# EAGLE design Display (EAGLE 7.7.0)
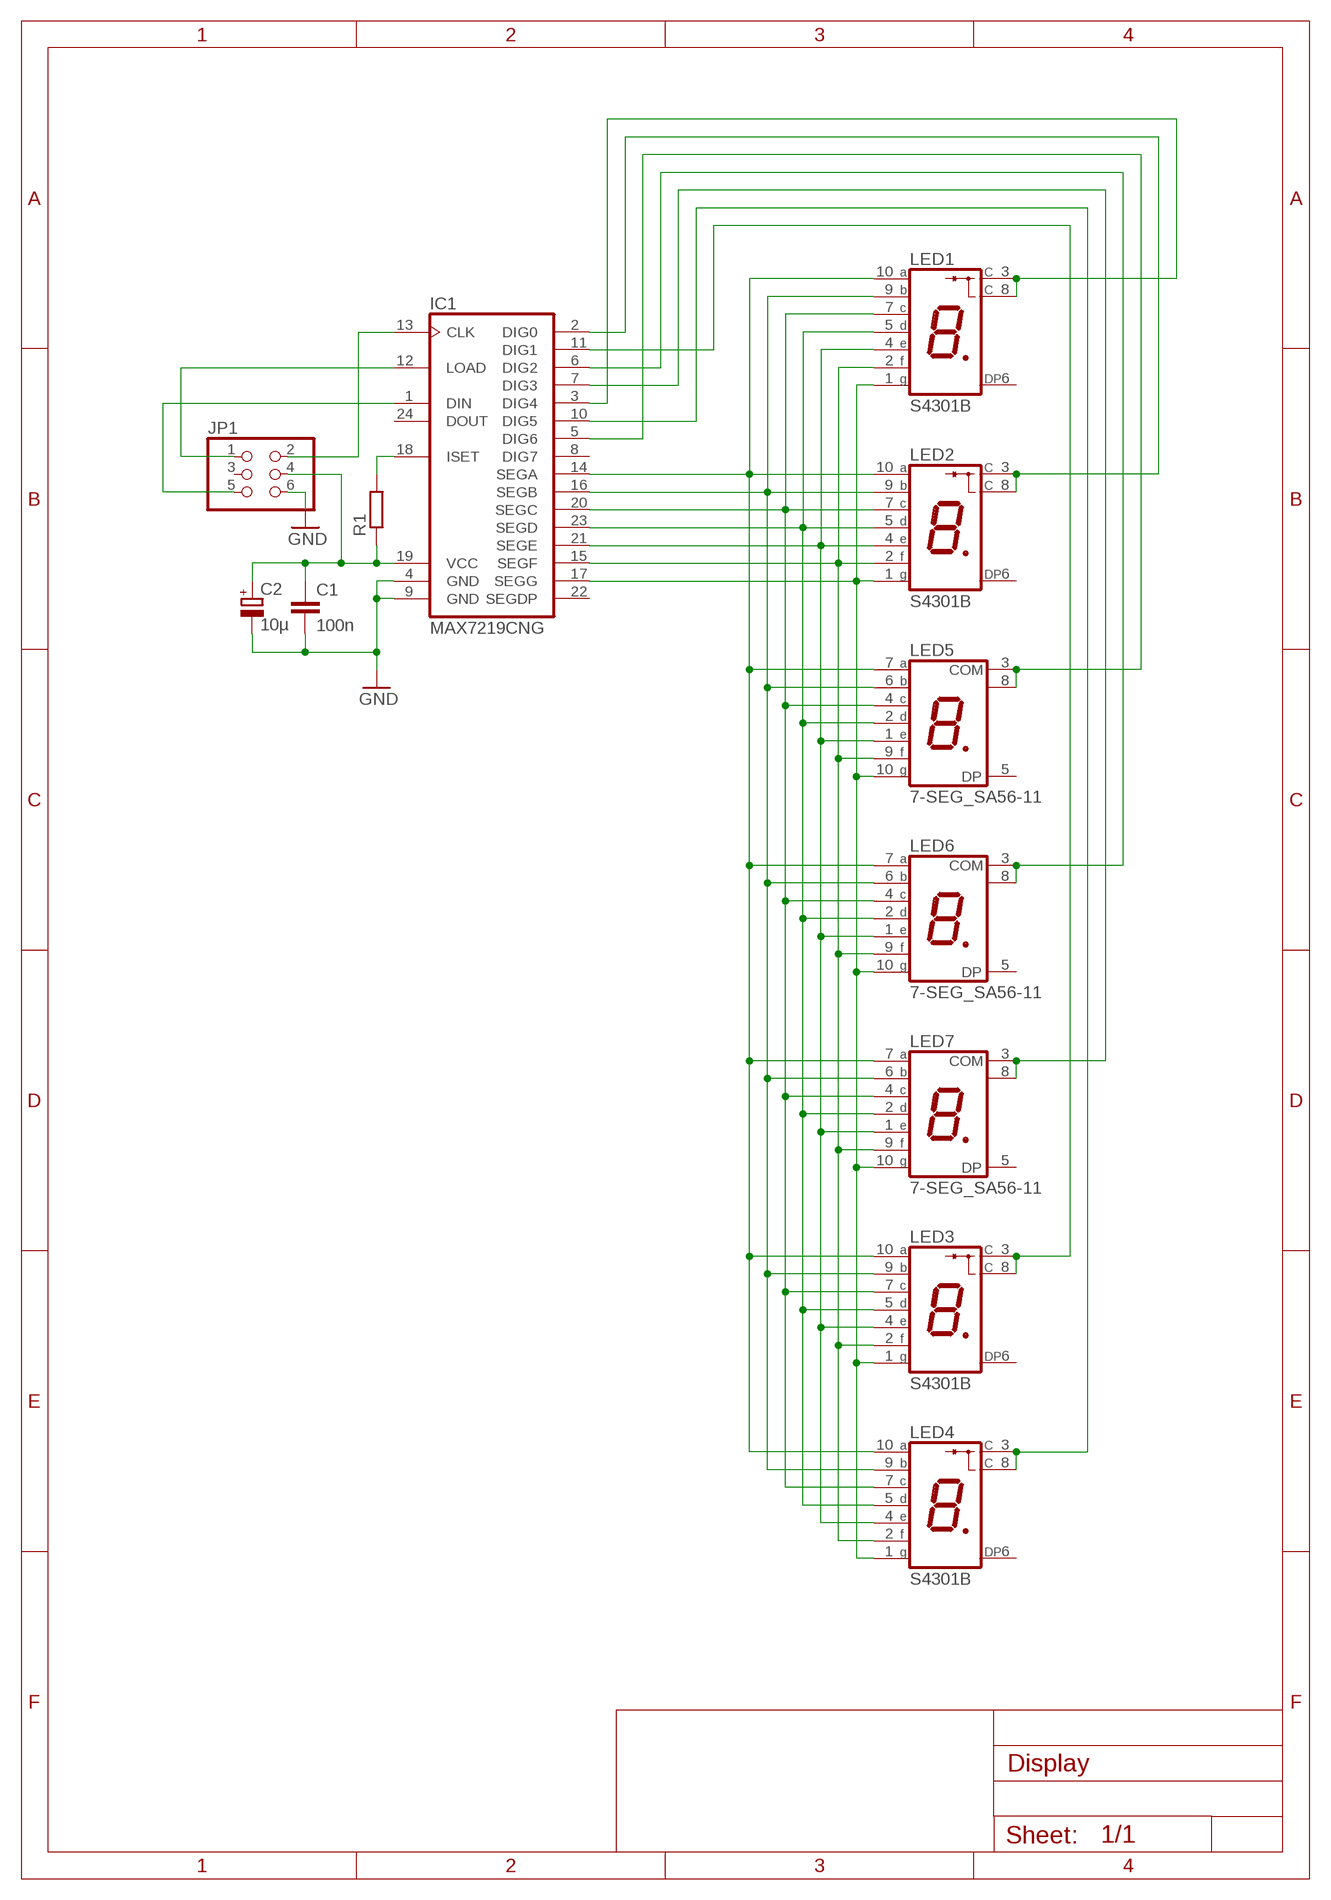
[diagram p0: schematic, sheet 1]

## Parts
C1  100n  C-EUC0805  [C0805]
C2  10µ  CPOL-EUB  [PANASONIC_B]
IC1  MAX7219CNG  [DIL24-3]
JP1  PINHD-2X03_2.54  [2X03]
LED1  S4301B  [S4301B]
LED2  S4301B  [S4301B]
LED3  S4301B  [S4301B]
LED4  S4301B  [S4301B]
LED5  7-SEG_SA56-11  [SA56-11]
LED6  7-SEG_SA56-11  [SA56-11]
LED7  7-SEG_SA56-11  [SA56-11]
R1  R-EU_R0805  [R0805]

## Nets
GND: C1.2 C2.- IC1.4(GND) IC1.9(GND) JP1.6
N$1: IC1.17(SEGG) LED1.1(G) LED2.1(G) LED3.1(G) LED4.1(G) LED5.10(G) LED6.10(G) LED7.10(G)
N$2: IC1.15(SEGF) LED1.2(F) LED2.2(F) LED3.2(F) LED4.2(F) LED5.9(F) LED6.9(F) LED7.9(F)
N$3: IC1.21(SEGE) LED1.4(E) LED2.4(E) LED3.4(E) LED4.4(E) LED5.1(E) LED6.1(E) LED7.1(E)
N$4: IC1.23(SEGD) LED1.5(D) LED2.5(D) LED3.5(D) LED4.5(D) LED5.2(D) LED6.2(D) LED7.2(D)
N$5: IC1.20(SEGC) LED1.7(C) LED2.7(C) LED3.7(C) LED4.7(C) LED5.4(C) LED6.4(C) LED7.4(C)
N$6: IC1.16(SEGB) LED1.9(B) LED2.9(B) LED3.9(B) LED4.9(B) LED5.6(B) LED6.6(B) LED7.6(B)
N$7: IC1.14(SEGA) LED1.10(A) LED2.10(A) LED3.10(A) LED4.10(A) LED5.7(A) LED6.7(A) LED7.7(A)
N$8: IC1.3(DIG4) LED1.3(C) LED1.8(C)
N$9: IC1.2(DIG0) LED2.3(C) LED2.8(C)
N$10: IC1.5(DIG6) LED5.3(COM) LED5.8(COM)
N$11: IC1.6(DIG2) LED6.3(COM) LED6.8(COM)
N$12: IC1.7(DIG3) LED7.3(COM) LED7.8(COM)
N$13: IC1.10(DIG5) LED4.3(C) LED4.8(C)
N$14: IC1.11(DIG1) LED3.3(C) LED3.8(C)
N$15: IC1.1(DIN) JP1.5
N$16: IC1.12(LOAD) JP1.1
N$17: IC1.13(CLK) JP1.2
N$18: C1.1 C2.+ IC1.19(VCC) JP1.4 R1.1
N$19: IC1.18(ISET) R1.2
Unconnected: IC1.8(DIG7) IC1.22(SEGDP) IC1.24(DOUT) JP1.3 LED1.6(DP) LED2.6(DP) LED3.6(DP) LED4.6(DP) LED5.5(DP) LED6.5(DP) LED7.5(DP)

## Library data of the parts
C1 = rcl:C-EU: CAPACITOR, European symbol
C2 = rcl:CPOL-EU: POLARIZED CAPACITOR, European symbol
IC1 = maxim7219:MAX7219*: Serially Interfaced, 8-Digit LED Display Drivers
JP1 = pinhead-2:PINHD-2X03: PIN HEADER
LED1-LED4 = led-7-segment:S4301B: Single Digit Seven-Segment Display (cathode common) Source: LITEON .. S4301B.pdf; OC_FARNELL: unknown; OC_NEWARK: unknown
LED5-LED7 = display-kingbright:7-SEG_: Kingbright 14.2mm (0.56 INCH) SINGLE DIGIT NUMERIC DUISPLAY Source: SA56-11EWA(Ver1189471036.pdf; OC_FARNELL: unknown; OC_NEWARK: unknown
R1 = rcl:R-EU_: RESISTOR, European symbol

## Board
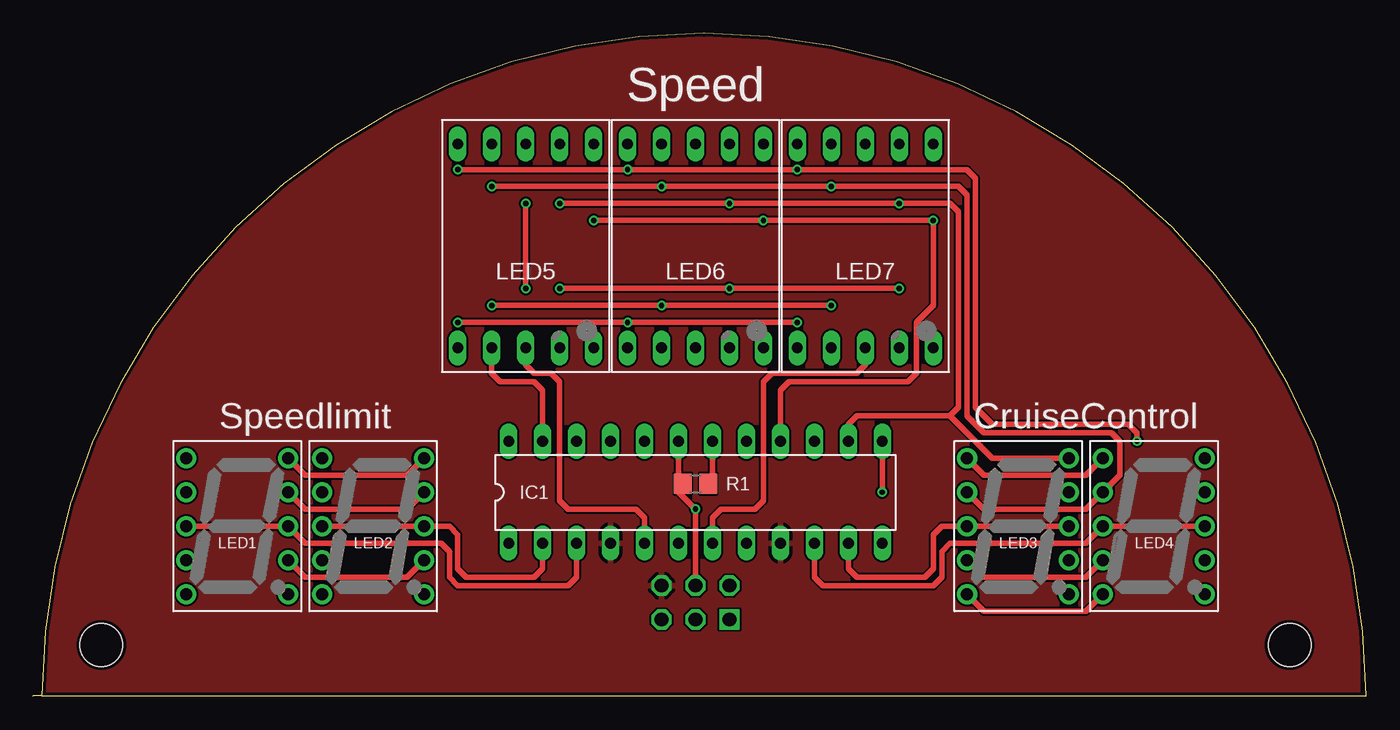
[diagram p1: board, top side]
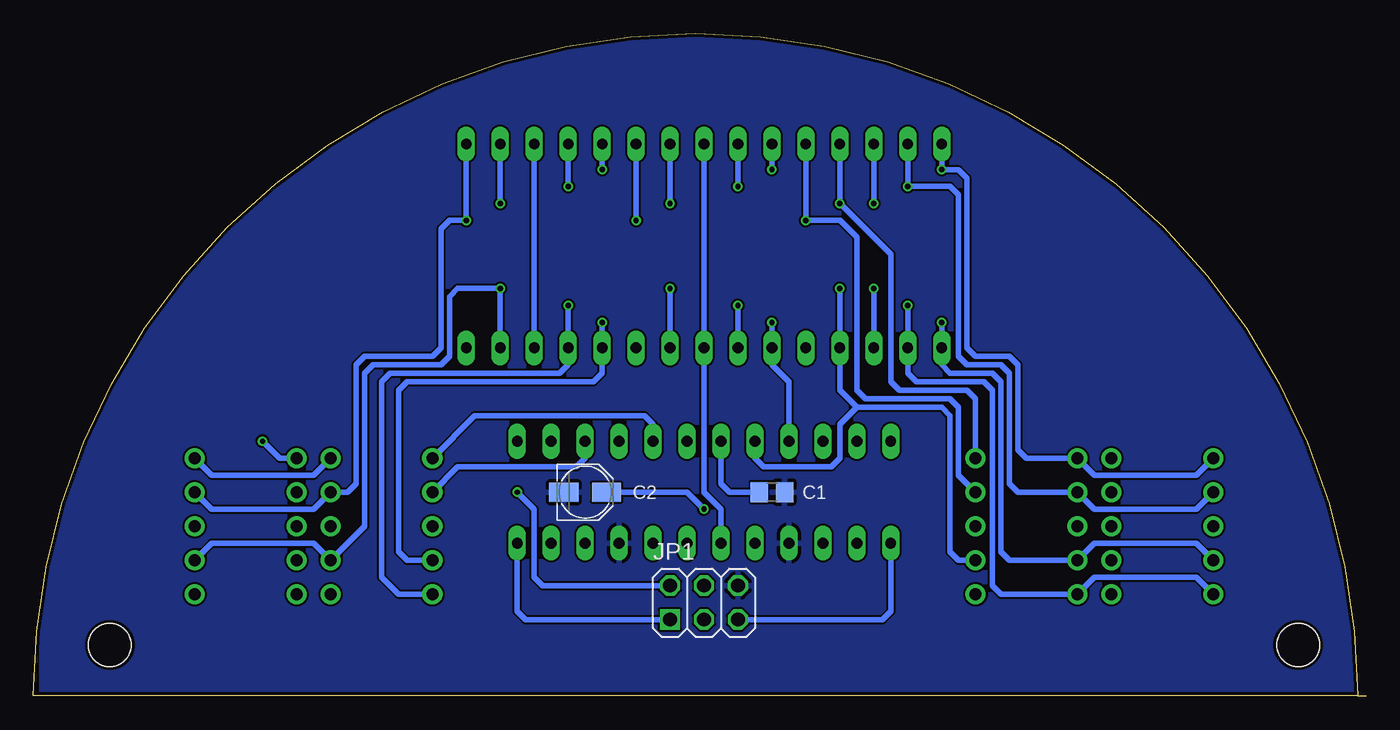
[diagram p2: board, bottom side, seen from below]

Size 99.69 x 49.56 mm. Coordinates in mm from the lower left corner, seen from the top.
Outline: 0.64,0.01 99.69,0.01 arc180 0.64,0.01
Outline: 0.64,0.01 0,0.01 0,0
Copper layers (1*16): Top 0.035mm / dielectric 1.5mm / Bottom 0.035mm
Design rules "Elecrow_2-layer_eagle_rule": minimum track width 6mil, minimum drill 12mil, track to track 6mil, track to pad 6mil, pad to pad 6mil, via to via 6mil, smd to smd 0mil, copper to edge 10mil, drill to drill 10mil, minimum pad ring 10mil, minimum via ring 6mil, stop-mask expansion 2mil, vias tented up to drill 100mil, thermal gap 10mil
Holes 3.2 mm at 5.08,3.82 93.98,3.82

### Footprints (pad centres in the part's own frame; a part is rotated, then mirrored left to right if it is on the bottom)
C0805 = smd 1.3 x 1.5: 1 -0.95,0; 2 0.95,0
PANASONIC_B = smd 2.2 x 1.4: + 1.6,0; - -1.6,0
DIL24-3 = drill 0.813 long: 1 -13.97,-3.81; 2 -11.43,-3.81; 3 -8.89,-3.81; 4 -6.35,-3.81; 5 -3.81,-3.81; 6 -1.27,-3.81; 7 1.27,-3.81; 8 3.81,-3.81; 9 6.35,-3.81; 10 8.89,-3.81; 11 11.43,-3.81; 12 13.97,-3.81; 13 13.97,3.81; 14 11.43,3.81; 15 8.89,3.81; 16 6.35,3.81; 17 3.81,3.81; 18 1.27,3.81; 19 -1.27,3.81; 20 -3.81,3.81; 21 -6.35,3.81; 22 -8.89,3.81; 23 -11.43,3.81; 24 -13.97,3.81
2X03 = drill 1.016 square: 1 -2.54,-1.27 | drill 1.016 octagon: 2 -2.54,1.27; 3 0,-1.27; 4 0,1.27; 5 2.54,-1.27; 6 2.54,1.27
S4301B = drill 0.9 pad 1.5: 1 -3.81,5.08; 2 -3.81,2.54; 3 -3.81,0; 4 -3.81,-2.54; 5 -3.81,-5.08; 6 3.81,-5.08; 7 3.81,-2.54; 8 3.81,0; 9 3.81,2.54; 10 3.81,5.08
SA56-11 = drill 0.8 long: 1 -5.08,-7.62; 2 -2.54,-7.62; 3 0,-7.62; 4 2.54,-7.62; 5 5.08,-7.62; 6 5.08,7.62; 7 2.54,7.62; 8 0,7.62; 9 -2.54,7.62; 10 -5.08,7.62
R0805 = smd 1.3 x 1.5: 1 -0.95,0; 2 0.95,0

### Placement (x,y rotation side)
C1  44.45,15.25 0 bottom
C2  58.42,15.25 0 bottom
IC1  49.53,15.25 0 top
JP1  49.53,7 0 bottom
LED1  15.24,12.71 0 top
LED2  25.4,12.71 0 top
LED3  73.66,12.71 0 top
LED4  83.82,12.71 0 top
LED5  36.83,33.66 0 top
LED6  49.53,33.66 0 top
LED7  62.23,33.66 0 top
R1  49.53,15.88 0 top

### Tracks (layer width: path | path; a pad name or v marks a point on that pad's centre or on a via)
GND
  pour Top: 0,0.01 0,56.52 99.06,56.52 99.06,0.01
  pour Bottom: 0,0.01 0,56.52 99.06,56.52 99.06,0.01
N$1  (via drill 0.4)
  Top 0.406: v31.75,39.38 v44.45,39.38 v57.15,39.38 69.85,39.38 70.48,38.74 70.48,21.6 71.75,20.33 81.92,20.33 82.55,19.7 v82.55,19.06 | LED3.1 71.12,16.52 78.74,16.52 LED4.1
  Bottom 0.406: LED5.10 v31.75,39.38 30.48,39.38 29.84,38.74 29.84,26.05 29.21,25.41 26.67,25.41 26.04,24.78 26.04,18.43 25.4,17.79 LED2.1 20.32,16.52 12.7,16.52 LED1.1 | LED6.10 v44.45,39.38 | v82.55,19.06 81.28,17.79 LED4.1 | LED3.1 66.67,20.96 53.98,20.96 53.34,20.33 IC1.17 | LED7.10 v57.15,39.38
N$2  (via drill 0.4)
  Top 0.406: v34.29,38.11 v46.99,38.11 v59.69,38.11 69.22,38.11 69.85,37.48 69.85,20.96 71.12,19.7 80.64,19.7 81.28,19.06 81.28,16.52 LED4.2 78.74,13.98 71.12,13.98 LED3.2
  Bottom 0.406: LED5.9 v34.29,38.11 31.11,38.11 30.48,37.48 30.48,25.41 29.84,24.78 27.3,24.78 26.67,24.14 26.67,15.88 26.04,15.25 LED2.2 20.32,13.98 12.7,13.98 LED1.2 | LED6.9 v46.99,38.11 | LED3.2 67.94,17.16 59.05,17.16 58.42,17.79 IC1.15 | LED7.9 v59.69,38.11
N$3  (via drill 0.4)
  Top 0.406: LED3.4 71.12,8.9 78.74,8.9 LED4.4 | v31.75,27.95 v44.45,27.95 v57.15,27.95
  Bottom 0.406: v31.75,27.95 LED5.1 31.75,24.78 31.11,24.14 27.94,24.14 27.3,23.51 27.3,10.8 26.67,10.17 LED2.4 20.32,11.44 12.7,11.44 LED1.4 | v44.45,27.95 LED6.1 44.45,24.78 43.18,23.51 IC1.21 | LED3.4 71.75,10.17 72.39,10.8 72.39,22.87 71.75,23.51 57.78,23.51 57.15,24.14 LED7.1 v57.15,27.95
N$4  (via drill 0.4)
  Top 0.406: LED3.5 71.12,6.36 78.74,6.36 LED4.5 | v34.29,29.22 v46.99,29.22 v59.69,29.22 | IC1.23 38.1,22.87 37.47,23.51 34.92,23.51 34.29,24.14 LED5.2
  Bottom 0.406: v34.29,29.22 LED5.2 34.29,24.14 33.66,23.51 28.57,23.51 27.94,22.87 27.94,8.27 27.3,7.63 LED2.5 20.32,8.9 12.7,8.9 LED1.5 | LED6.2 v46.99,29.22 | LED3.5 72.39,7.63 73.66,8.9 73.66,23.51 73.03,24.14 60.33,24.14 59.69,24.78 LED7.2 v59.69,29.22
N$5  (via drill 0.4)
  Top 0.406: v39.37,30.49 v52.07,30.49 v64.77,30.49 | LED1.7 20.32,8.9 27.94,8.9 LED2.7
  Bottom 0.406: LED4.7 86.36,11.44 78.74,11.44 LED3.7 74.93,12.71 74.93,24.14 74.3,24.78 69.22,24.78 68.58,25.41 68.58,29.86 67.94,30.49 v64.77,30.49 LED7.4 | v39.37,30.49 LED5.4 39.37,22.87 38.1,21.6 | LED6.4 v52.07,30.49 | LED2.7 30.48,10.17 31.11,10.8 31.11,20.96 31.75,21.6 38.1,21.6 | IC1.20 45.72,17.79 45.09,17.16 40.01,17.16 39.37,17.79 39.37,20.33 38.1,21.6
N$6  (via drill 0.4)
  Top 0.406: v41.91,35.57 v54.61,35.57 v67.31,35.57 67.31,29.22 66.04,27.95 66.04,24.14 65.41,23.51 56.52,23.51 55.88,22.87 IC1.16 | LED1.9 20.32,13.98 27.94,13.98 LED2.9
  Bottom 0.406: LED5.6 v41.91,35.57 39.37,35.57 38.1,34.3 38.1,22.87 37.47,22.24 31.11,22.24 30.48,21.6 30.48,16.52 LED2.9 | LED6.6 v54.61,35.57 | LED4.9 86.36,13.98 78.74,13.98 LED3.9 76.2,15.25 75.56,15.88 75.56,24.78 74.93,25.41 69.85,25.41 69.22,26.05 69.22,34.93 68.58,35.57 v67.31,35.57 LED7.6
N$7  (via drill 0.4)
  Top 0.406: v39.37,36.84 v52.07,36.84 v64.77,36.84 68.58,36.84 69.22,36.2 69.22,21.6 68.58,20.96 | LED1.10 20.32,16.52 27.94,16.52 LED2.10 | IC1.14 60.96,20.33 61.59,20.96 68.58,20.96 | 68.58,20.96 71.75,17.79 LED3.10
  Bottom 0.406: LED5.7 v39.37,36.84 35.56,33.03 35.56,23.51 34.92,22.87 29.84,22.87 29.21,22.24 LED2.10 | LED6.7 v52.07,36.84 | LED3.10 78.74,16.52 86.36,16.52 LED4.10 | LED7.7 v64.77,36.84
N$8
  Top 0.406: IC1.3 40.64,8.9 40.01,8.27 31.75,8.27 31.11,8.9 31.11,10.8 30.48,11.44 20.32,11.44 LED1.8 LED1.3
N$9
  Top 0.406: IC1.2 38.1,9.54 37.47,8.9 32.38,8.9 31.75,9.54 31.75,12.07 31.11,12.71 LED2.8 LED2.3
N$10  (via drill 0.4)
  Top 0.406: v36.83,30.49 v36.83,36.84 | IC1.5 45.72,13.35 45.09,13.98 40.01,13.98 39.37,14.62 39.37,23.51 38.73,24.14 37.47,24.14 36.83,24.78 LED5.3
  Bottom 0.406: LED5.3 v36.83,30.49 | v36.83,36.84 LED5.8
N$11
  Bottom 0.406: LED6.8 LED6.3 49.53,15.25 48.26,13.98 IC1.6
N$12
  Top 0.406: IC1.7 50.8,13.35 51.44,13.98 53.98,13.98 54.61,14.62 54.61,23.51 55.24,24.14 61.59,24.14 62.23,24.78 LED7.3
  Bottom 0.406: LED7.3 LED7.8
N$13
  Top 0.406: LED4.8 LED4.3 78.74,11.44 68.58,11.44 67.94,10.8 67.94,8.9 67.31,8.27 59.05,8.27 58.42,8.9 IC1.10
N$14
  Top 0.406: LED3.8 LED3.3 67.94,12.71 67.31,12.07 67.31,9.54 66.67,8.9 61.59,8.9 60.96,9.54 IC1.11
N$15
  Bottom 0.406: JP1.5 36.2,5.72 35.56,6.36 IC1.1
N$16
  Bottom 0.406: JP1.1 62.87,5.72 63.5,6.36 IC1.12
N$17  (via drill 0.4)
  Top 0.406: v63.5,15.25 IC1.13
  Bottom 0.406: JP1.2 61.59,8.27 62.23,8.9 62.23,13.98 v63.5,15.25
N$18  (via drill 0.4)
  Top 0.406: JP1.4 v49.53,13.98 48.26,15.25 48.26,15.88 | 48.26,15.88 IC1.19 | R1.1 48.26,15.88
  Bottom 0.406: C1.1 47.62,15.25 48.26,15.88 IC1.19 | C2.+ 50.8,15.25 v49.53,13.98
N$19
  Top 0.406: R1.2 50.8,16.21 IC1.18

### Text on the board
tPlace: Speed | Speedlimit | CruiseControl